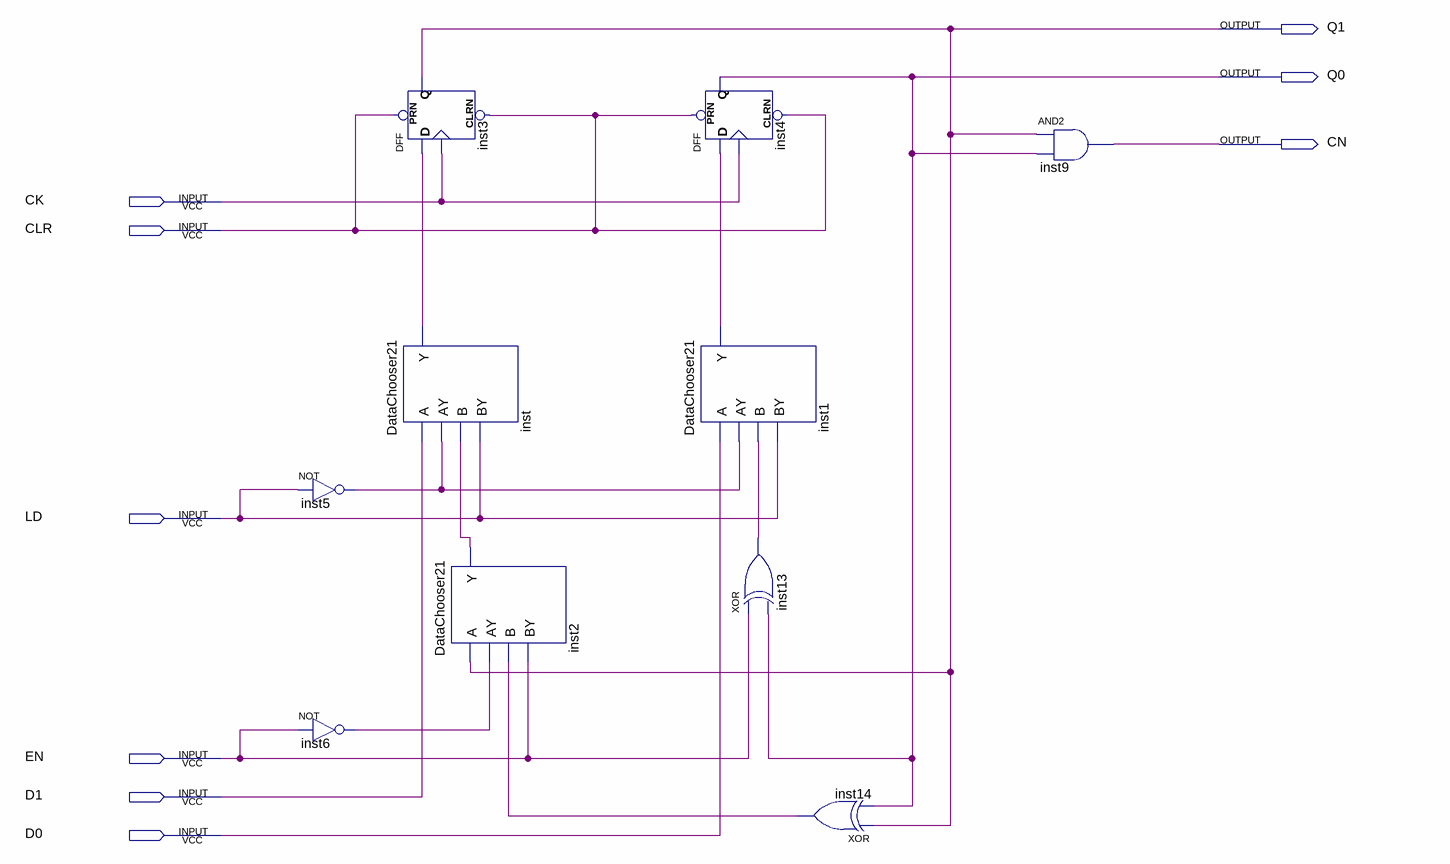
[diagram p0: schematic sheet]
// Quartus schematic Counter2bit.bdf as structural Verilog: 10 symbols, 9 pins
module Counter2bit (
  input  CK,
  input  CLR,
  input  LD,
  input  EN,
  input  D1,
  input  D0,
  output Q1,
  output Q0,
  output CN
);

  wire inst1_y, inst2_y, inst5_out, inst6_out, inst13_out, inst14_out, inst_y;

  not inst5 (inst5_out, LD);
  not inst6 (inst6_out, EN);
  DFF inst3 (.CLRN(CLR), .CLK(CK), .D(inst_y), .PRN(CLR), .Q(Q1));
  DataChooser21 inst (.A(D1), .AY(inst5_out), .B(inst2_y), .BY(LD), .Y(inst_y));
  DataChooser21 inst2 (.A(Q1), .AY(inst6_out), .B(inst14_out), .BY(EN), .Y(inst2_y));
  DFF inst4 (.CLRN(CLR), .CLK(CK), .D(inst1_y), .PRN(CLR), .Q(Q0));
  DataChooser21 inst1 (.A(D0), .AY(inst5_out), .B(inst13_out), .BY(LD), .Y(inst1_y));
  xor inst13 (inst13_out, EN, Q0);
  xor inst14 (inst14_out, Q1, Q0);
  and inst9 (CN, Q1, Q0);
endmodule
